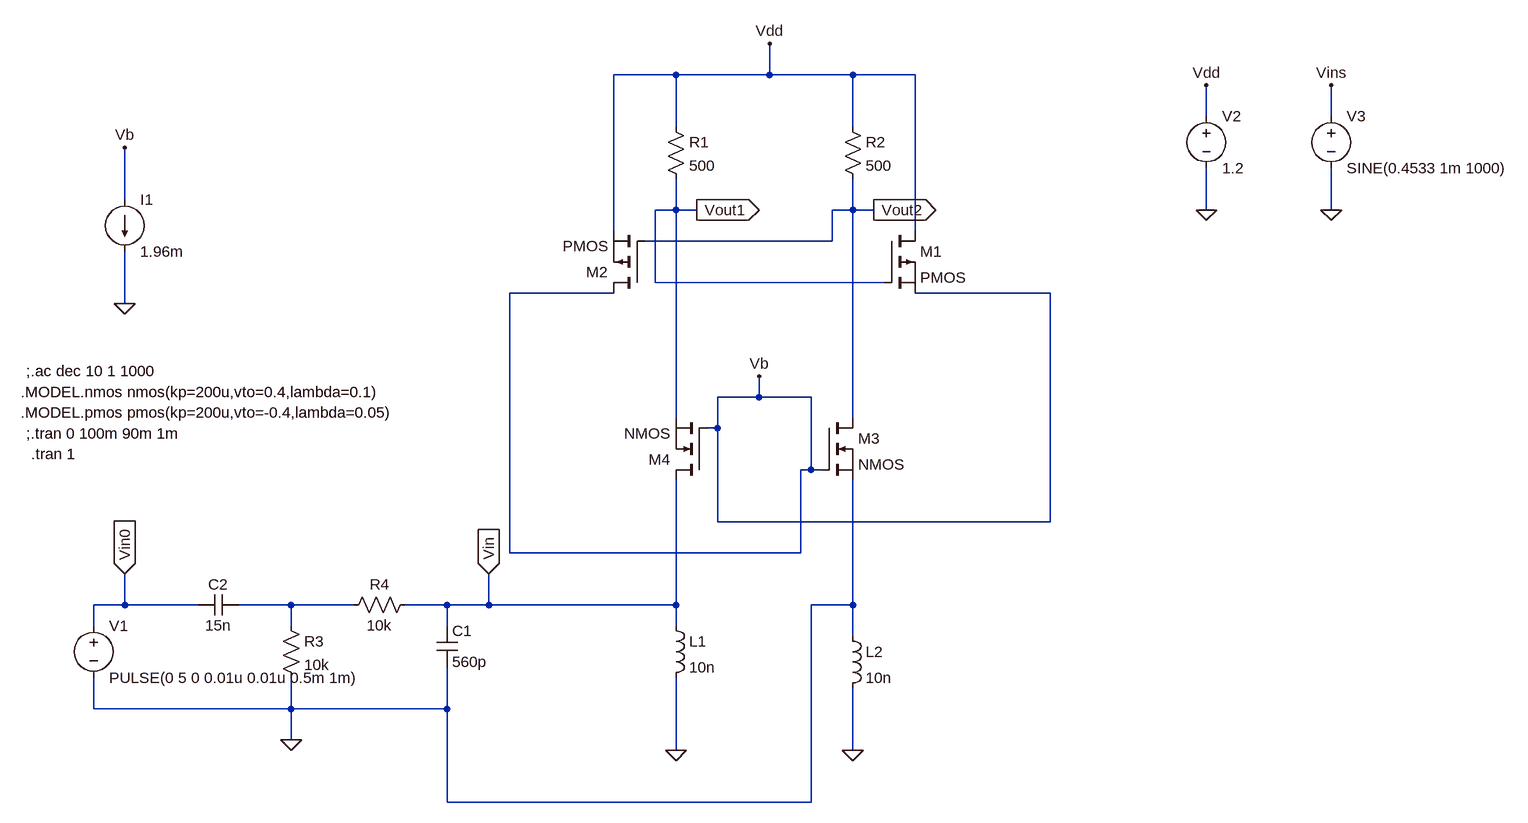
[diagram p0: schematic DifferentialLNA.asc]
DifferentialLNA.asc, the LTspice schematic file:
Version 4
SHEET 1 1288 964
WIRE -16 -160 -112 -160
WIRE 128 -160 128 -208
WIRE 128 -160 -16 -160
WIRE 256 -160 128 -160
WIRE 352 -160 256 -160
WIRE 800 -96 800 -144
WIRE 992 -96 992 -144
WIRE -16 -80 -16 -160
WIRE 256 -80 256 -160
WIRE -864 32 -864 -48
WIRE -16 48 -16 0
WIRE -16 48 -48 48
WIRE 16 48 -16 48
WIRE 256 48 256 0
WIRE 256 48 224 48
WIRE 288 48 256 48
WIRE 800 48 800 -16
WIRE 992 48 992 -16
WIRE -112 80 -112 -160
WIRE 352 80 352 -160
WIRE 224 96 224 48
WIRE 224 96 -64 96
WIRE -48 160 -48 48
WIRE 304 160 -48 160
WIRE -112 176 -272 176
WIRE 560 176 352 176
WIRE -864 192 -864 112
WIRE 112 336 112 304
WIRE 112 336 48 336
WIRE 192 336 112 336
WIRE -16 368 -16 48
WIRE 256 368 256 48
WIRE 48 384 48 336
WIRE 48 384 32 384
WIRE 192 448 192 336
WIRE 192 448 176 448
WIRE 208 448 192 448
WIRE 48 528 48 384
WIRE 560 528 560 176
WIRE 560 528 48 528
WIRE -272 576 -272 176
WIRE 176 576 176 448
WIRE 176 576 -272 576
WIRE -864 656 -864 608
WIRE -864 656 -912 656
WIRE -752 656 -864 656
WIRE -608 656 -688 656
WIRE -512 656 -608 656
WIRE -368 656 -432 656
WIRE -304 656 -304 608
WIRE -304 656 -368 656
WIRE -16 656 -16 464
WIRE -16 656 -304 656
WIRE 256 656 256 464
WIRE 256 656 192 656
WIRE -912 688 -912 656
WIRE -608 688 -608 656
WIRE -368 688 -368 656
WIRE -16 688 -16 656
WIRE 256 704 256 656
WIRE -912 816 -912 768
WIRE -608 816 -608 768
WIRE -608 816 -912 816
WIRE -368 816 -368 752
WIRE -368 816 -608 816
WIRE -608 864 -608 816
WIRE -16 880 -16 768
WIRE 256 880 256 784
WIRE -368 960 -368 816
WIRE 192 960 192 656
WIRE 192 960 -368 960
FLAG 800 48 0
FLAG 992 48 0
FLAG -864 192 0
FLAG -608 864 0
FLAG -16 880 0
FLAG 256 880 0
FLAG 112 304 Vb
FLAG -864 -48 Vb
FLAG 128 -208 Vdd
FLAG 800 -144 Vdd
FLAG 992 -144 Vins
FLAG -864 608 Vin0
IOPIN -864 608 In
FLAG -304 608 Vin
IOPIN -304 608 In
FLAG 16 48 Vout1
IOPIN 16 48 Out
FLAG 288 48 Vout2
IOPIN 288 48 Out
SYMBOL pmos 304 80 R0
SYMATTR InstName M1
SYMBOL pmos -64 176 R180
SYMATTR InstName M2
SYMBOL nmos 208 368 R0
SYMATTR InstName M3
SYMBOL nmos 32 464 R180
SYMATTR InstName M4
SYMBOL res -32 -96 R0
SYMATTR InstName R1
SYMATTR Value 500
SYMBOL res 240 -96 R0
SYMATTR InstName R2
SYMATTR Value 500
SYMBOL ind -32 672 R0
SYMATTR InstName L1
SYMATTR Value 10n
SYMBOL ind 240 688 R0
SYMATTR InstName L2
SYMATTR Value 10n
SYMBOL cap -384 688 R0
SYMATTR InstName C1
SYMATTR Value 560p
SYMBOL cap -688 640 R90
WINDOW 0 0 32 VBottom 2
WINDOW 3 32 32 VTop 2
SYMATTR InstName C2
SYMATTR Value 15n
SYMBOL res -624 672 R0
SYMATTR InstName R3
SYMATTR Value 10k
SYMBOL res -416 640 R90
WINDOW 0 0 56 VBottom 2
WINDOW 3 32 56 VTop 2
SYMATTR InstName R4
SYMATTR Value 10k
SYMBOL voltage -912 672 R0
WINDOW 123 0 0 Left 0
WINDOW 39 0 0 Left 0
SYMATTR InstName V1
SYMATTR Value PULSE(0 5 0 0.01u 0.01u 0.5m 1m)
SYMBOL voltage 800 -112 R0
WINDOW 123 0 0 Left 0
WINDOW 39 0 0 Left 0
SYMATTR InstName V2
SYMATTR Value 1.2
SYMBOL voltage 992 -112 R0
WINDOW 123 0 0 Left 0
WINDOW 39 0 0 Left 0
SYMATTR InstName V3
SYMATTR Value SINE(0.4533 1m 1000)
SYMBOL current -864 32 R0
WINDOW 123 0 0 Left 0
WINDOW 39 0 0 Left 0
SYMATTR InstName I1
SYMATTR Value 1.96m
TEXT -1016 296 Left 2 !;.ac dec 10 1 1000
TEXT -1024 328 Left 2 !.MODEL.nmos nmos(kp=200u,vto=0.4,lambda=0.1)
TEXT -1024 360 Left 2 !.MODEL.pmos pmos(kp=200u,vto=-0.4,lambda=0.05)
TEXT -1016 392 Left 2 !;.tran 0 100m 90m 1m
TEXT -1008 424 Left 2 !.tran 1

The netlist it stands for:
* DifferentialLNA.asc
M1 Vdd Vout1 Vb Vb PMOS
M2 Vb Vout2 Vdd Vdd PMOS
M3 Vout2 Vb 0 0 NMOS
M4 Vin Vb Vout1 Vout1 NMOS
R1 Vdd Vout1 500
R2 Vdd Vout2 500
L1 Vin 0 10n
L2 0 0 10n
C1 Vin 0 560p
C2 N001 Vin0 15n
R3 N001 0 10k
R4 Vin N001 10k
V1 Vin0 0 PULSE(0 5 0 0.01u 0.01u 0.5m 1m)
V2 Vdd 0 1.2
V3 Vins 0 SINE(0.4533 1m 1000)
I1 Vb 0 1.96m
.model NMOS NMOS
.model PMOS PMOS
.lib standard.mos
;.ac dec 10 1 1000
.MODEL.nmos nmos(kp=200u,vto=0.4,lambda=0.1)
.MODEL.pmos pmos(kp=200u,vto=-0.4,lambda=0.05)
;.tran 0 100m 90m 1m
.tran 1
.backanno
.end